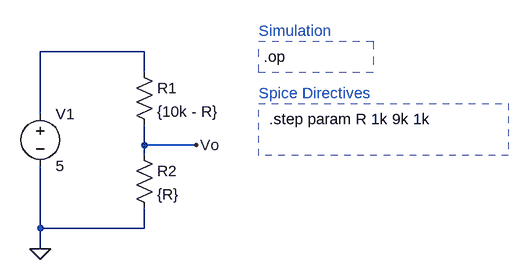
[diagram p0: schematic Variable_Resistor_1.asc]
Variable_Resistor_1.asc, the LTspice schematic file:
Version 4
SHEET 1 1432 696
WIRE 464 80 304 80
WIRE 464 112 464 80
WIRE 304 176 304 80
WIRE 464 224 464 192
WIRE 544 224 464 224
WIRE 464 240 464 224
WIRE 304 352 304 256
WIRE 464 352 464 320
WIRE 464 352 304 352
WIRE 304 384 304 352
FLAG 304 384 0
FLAG 544 224 Vo
SYMBOL res 448 96 R0
SYMATTR InstName R1
SYMATTR Value {10k - R}
SYMBOL res 448 224 R0
SYMATTR InstName R2
SYMATTR Value {R}
SYMBOL voltage 304 160 R0
SYMATTR InstName V1
SYMATTR Value 5
TEXT 640 48 Left 2 ;Simulation
TEXT 656 184 Left 2 !.step param R 1k 9k 1k
TEXT 648 88 Left 2 !.op
TEXT 640 144 Left 2 ;Spice Directives
RECTANGLE Normal 816 112 640 64 2
RECTANGLE Normal 1024 240 640 160 2

The netlist it stands for:
* Variable_Resistor_1.asc
R1 N001 Vo {10k - R}
R2 Vo 0 {R}
V1 N001 0 5
* Simulation
.step param R 1k 9k 1k
.op
* Spice Directives
.backanno
.end